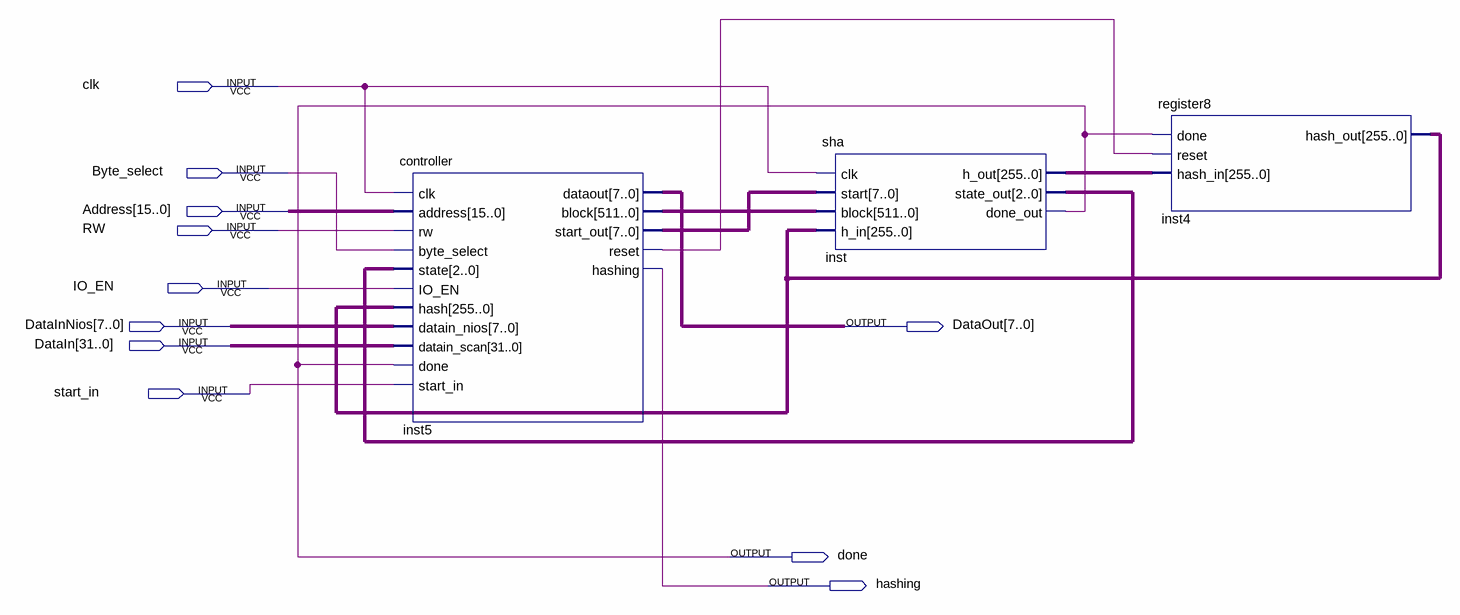
[diagram p0: schematic sheet]
// Quartus schematic sha_block.bdf as structural Verilog: 3 symbols, 11 pins
module sha_block (
  input  clk,
  input  Byte_select,
  input  [15:0] Address,
  input  RW,
  input  IO_EN,
  input  [7:0] DataInNios,
  input  [31:0] DataIn,
  input  start_in,
  output [7:0] DataOut,
  output done,
  output hashing
);

  wire inst5_reset;
  wire [2:0] inst_state_out;
  wire [7:0] inst5_start_out;
  wire [255:0] inst4_hash_out, inst_h_out;
  wire [511:0] inst5_block;

  controller inst5 (
    .clk(clk), .address(Address), .rw(RW), .byte_select(Byte_select), .state(inst_state_out), .IO_EN(IO_EN),
    .hash(inst4_hash_out), .datain_nios(DataInNios), .datain_scan(DataIn), .done(done), .start_in(start_in),
    .dataout(DataOut), .block(inst5_block), .start_out(inst5_start_out), .reset(inst5_reset),
    .hashing(hashing));
  sha inst (
    .clk(clk), .start(inst5_start_out), .block(inst5_block), .h_in(inst4_hash_out), .h_out(inst_h_out),
    .state_out(inst_state_out), .done_out(done));
  register8 inst4 (.done(done), .reset(inst5_reset), .hash_in(inst_h_out), .hash_out(inst4_hash_out));
endmodule
